# EAGLE design VA-Meter_Power_Supply (EAGLE 6.6.0)
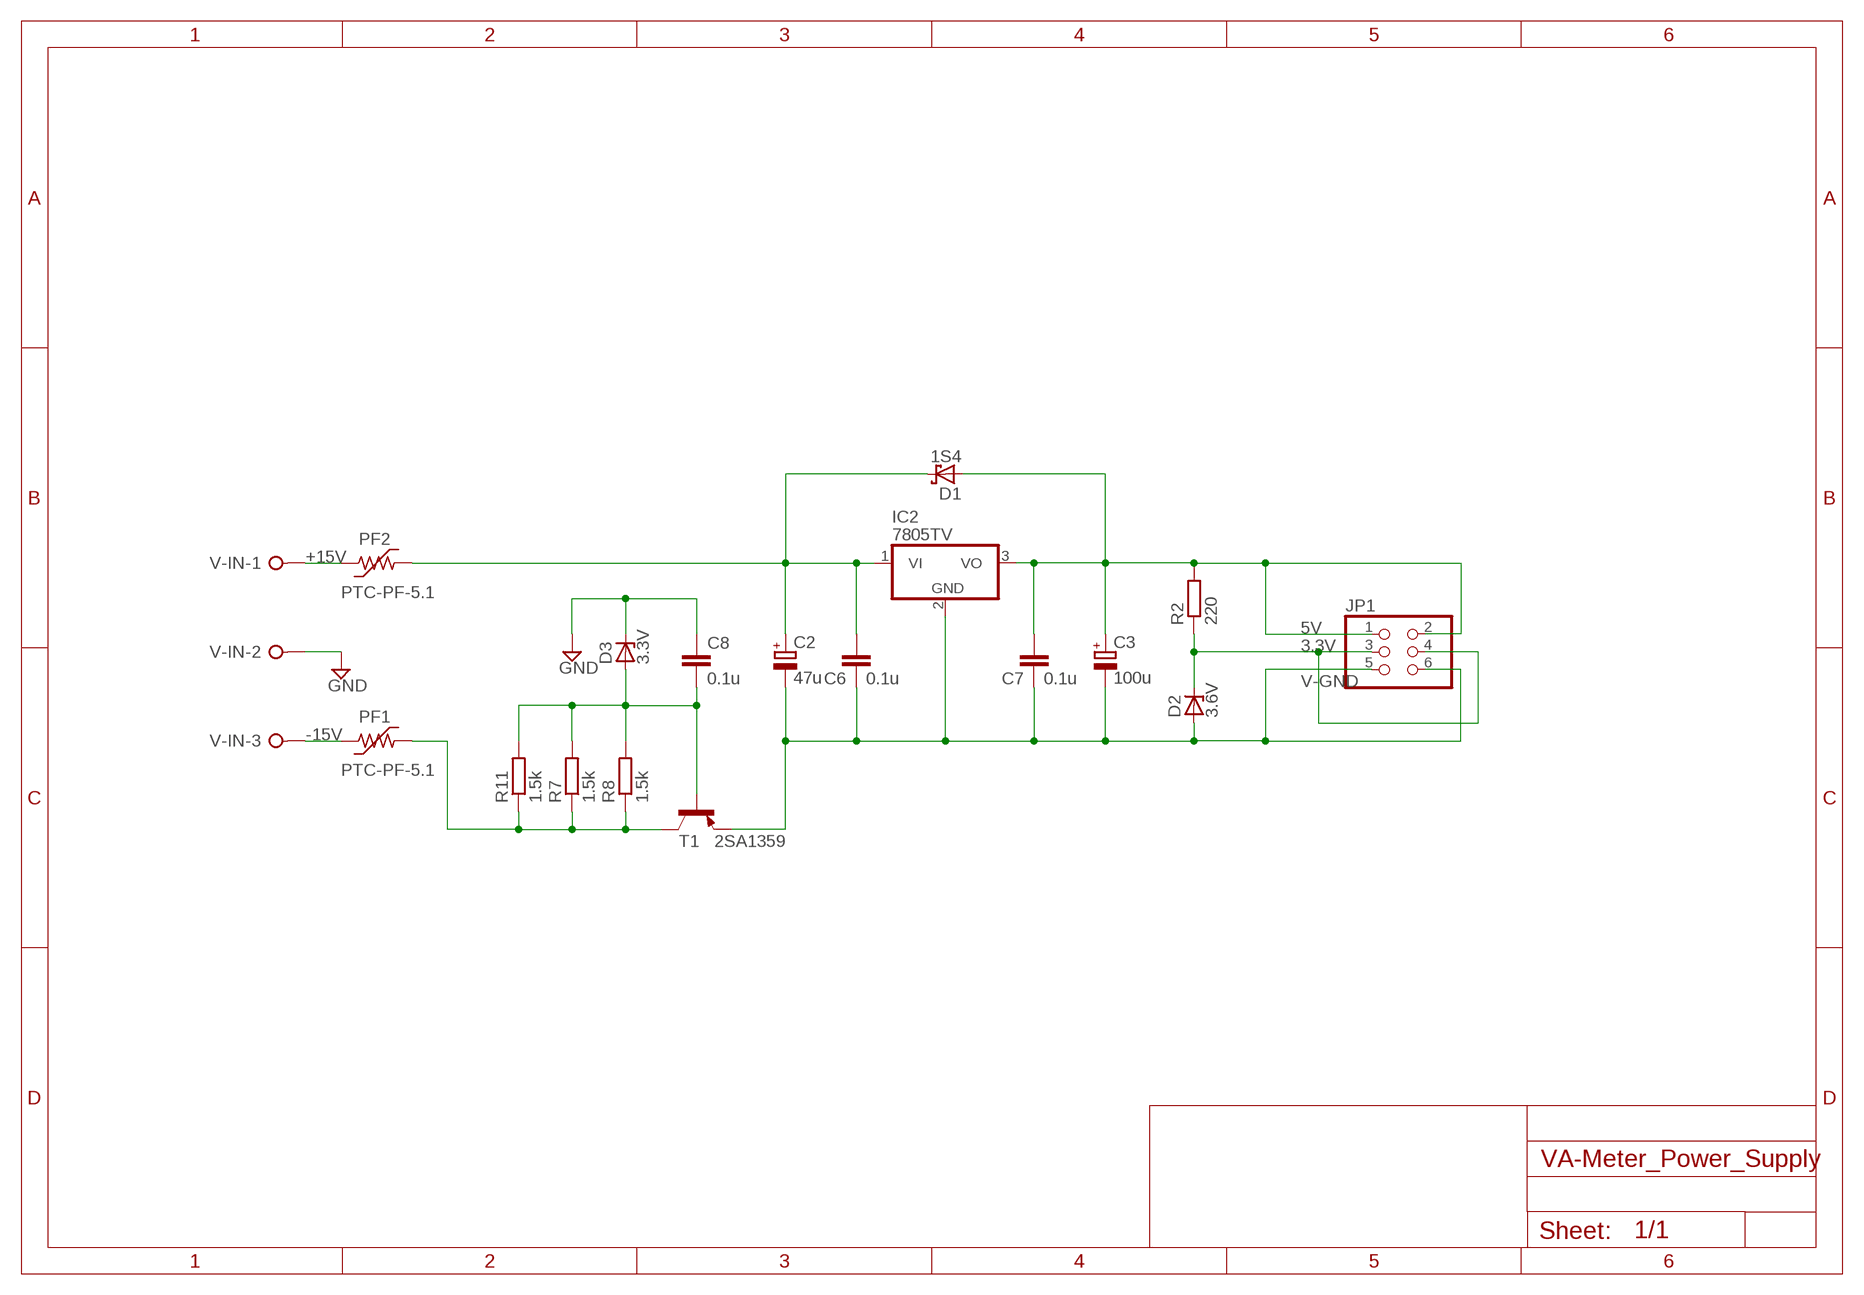
[diagram p0: schematic, sheet 1]

## Parts
C2  47u  CPOL-EUE2.5-5  [E2,5-5]
C3  100u  CPOL-EUE2.5-6  [E2,5-6]
C6  0.1u  C-EU050-024X044  [C050-024X044]
C7  0.1u  C-EU050-024X044  [C050-024X044]
C8  0.1u  C-EU050-024X044  [C050-024X044]
D1  1S4  SCHOTTKY-DIODEDO35-7  [DO35-7]
D2  3.6V  ZENER-DIODEZD-5  [ZDIO-5]
D3  3.3V  ZENER-DIODEZD-5  [ZDIO-5]
IC2  7805TV  [TO220V]
JP1  PINHD-2X3  [2X03]
PF1  PTC-PF-5.1  [PF-5.1]
PF2  PTC-PF-5.1  [PF-5.1]
R2  220  R-EU_0204/7  [0204/7]
R7  1.5k  R-EU_0207/7  [0207/7]
R8  1.5k  R-EU_0207/7  [0207/7]
R11  1.5k  R-EU_0207/7  [0207/7]
T1  2SA1359  -PNP-TO126V  [TO126V]
V-IN  W237-03P  [W237-133]

## Nets
3.3V: D2.C JP1.3 JP1.4 R2.1
5V: C3.+ C7.2 D1.A IC2.3(VO) JP1.1 JP1.2 R2.2
+15V: C2.+ C6.2 D1.C IC2.1(VI) PF2.2
-15V: PF1.2 R7.1 R8.1 R11.1 T1.2(C)
GND: C8.1 D3.C V-IN.2
N$2: C8.2 D3.A R7.2 R8.2 R11.2 T1.3(B)
N$6: PF2.1 V-IN.1
N$7: PF1.1 V-IN.3
V-GND: C2.- C3.- C6.1 C7.1 D2.A IC2.2(GND) JP1.5 JP1.6 T1.1(E)

## Library data of the parts
C2 C3 = rcl:CPOL-EU: POLARIZED CAPACITOR, European symbol
C6-C8 = rcl:C-EU: CAPACITOR, European symbol
D1 = diode:SCHOTTKY-DIODE: Schottky Diode
D2 D3 = diode:ZENER-DIODE: Z-Diode
IC2 = linear:78*: Positive VOLTAGE REGULATOR Source: http://cache.national.com/ds/LM/LM78L05.pdf http://www.fairchildsemi.com/ds/LM/LM7805.pdf
JP1 = pinhead:PINHD-2X3: PIN HEADER
PF1 PF2 = polyswitch:PTC-: POLYSWITCH Polyswitch Resetable Fuses
R2 R7 R8 R11 = rcl:R-EU_: RESISTOR, European symbol
T1 = transistor:*-PNP-: PNP Transistror
V-IN = con-wago-508:W237-03P: WAGO SREW CLAMP; OC_FARNELL: unknown; OC_NEWARK: unknown

## Board
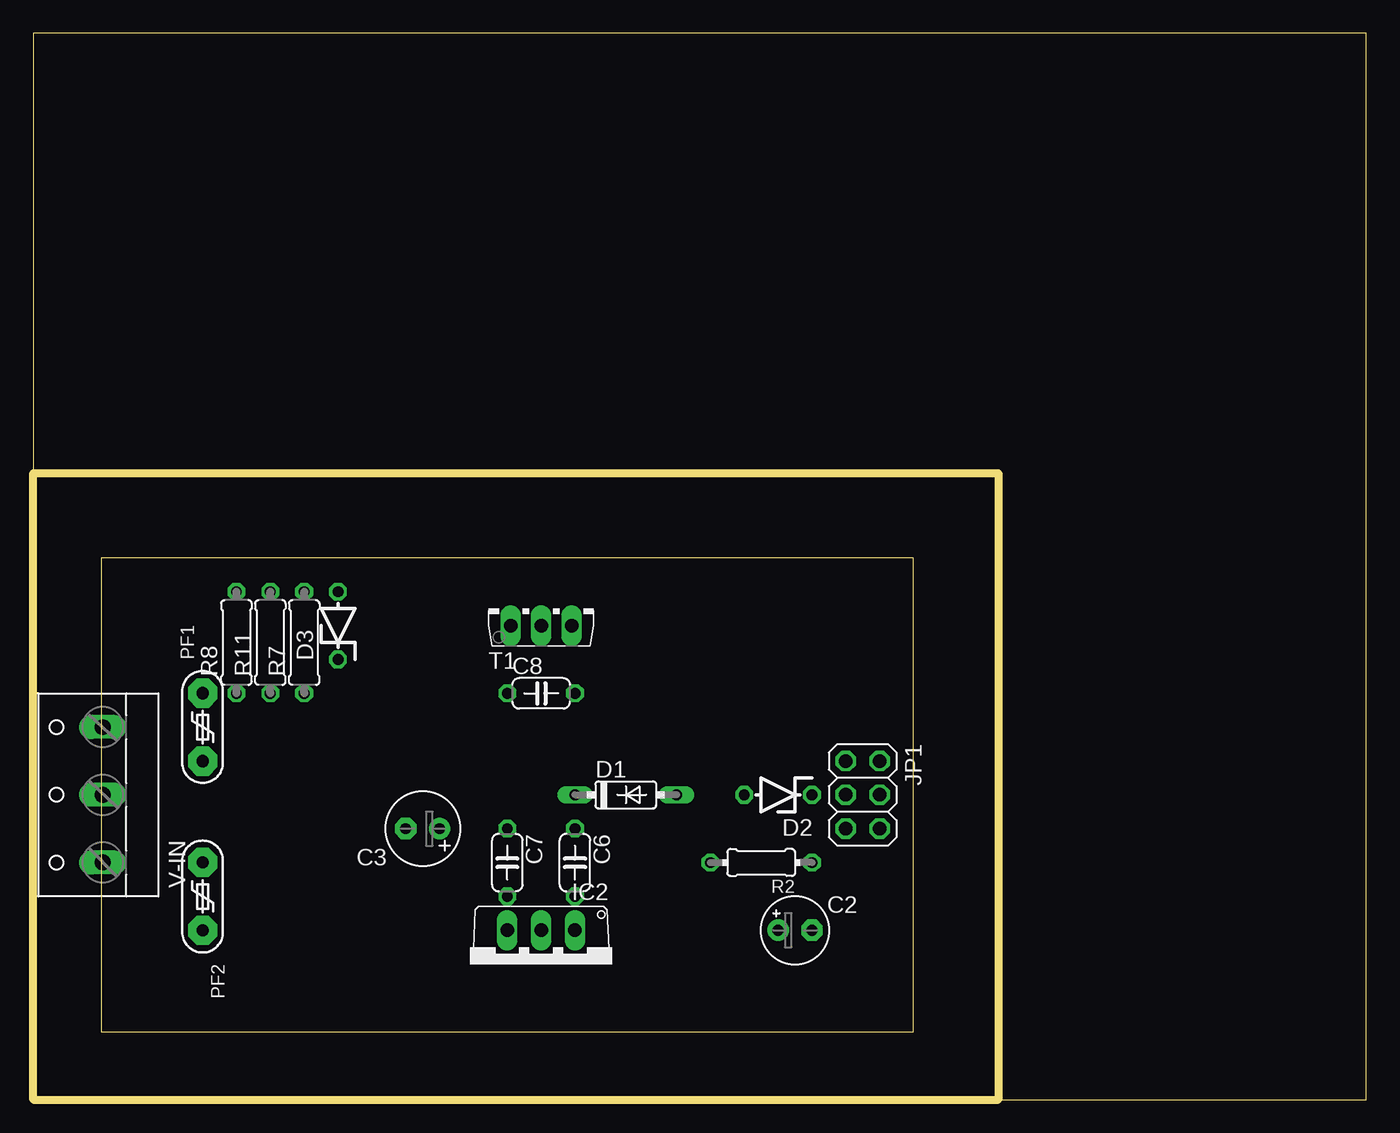
[diagram p1: board, top side]
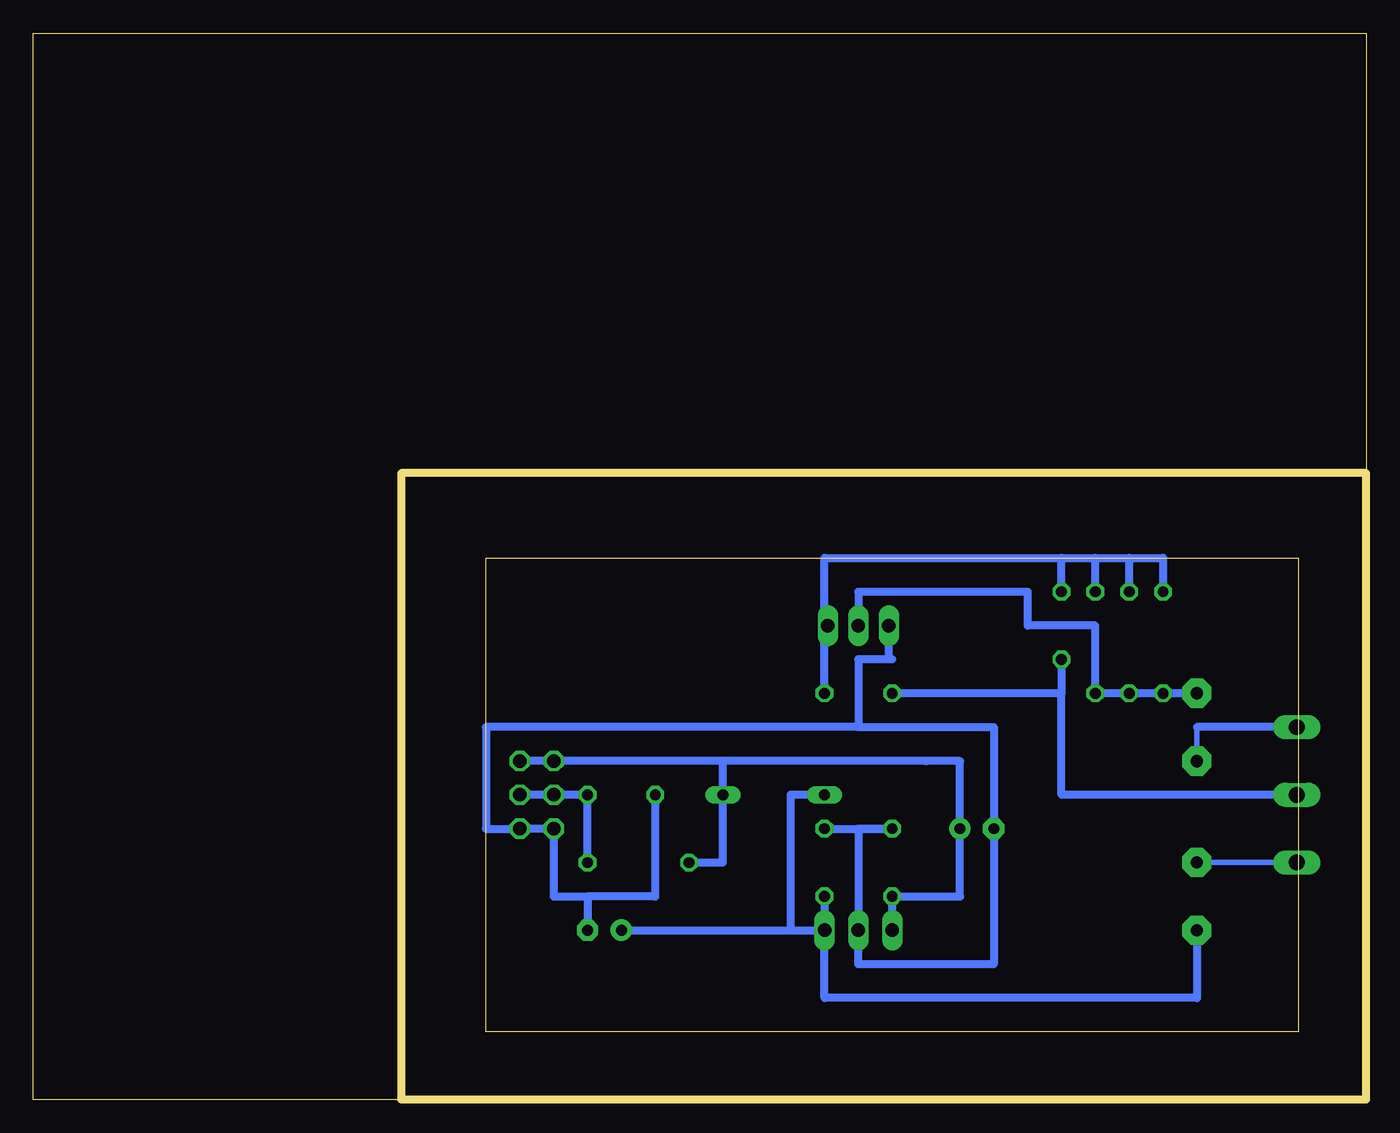
[diagram p2: board, bottom side, seen from below]

Size 100 x 80 mm. Coordinates in mm from the lower left corner, seen from the top.
Outline: 72.39,0 100,0 100,80 0,80 0,46.99
Outline: 0,46.99 0,0 72.39,0
Outline: 0,46.99 72.39,46.99 72.39,0
Outline: 5.08,5.08 66.04,5.08 66.04,40.64 5.08,40.64 5.08,5.08
Copper layers (1*16): Top 0.035mm / dielectric 1.5mm / Bottom 0.035mm
Design rules "default": minimum track width 10mil, minimum drill 24mil, track to track 8mil, track to pad 8mil, pad to pad 8mil, via to via 8mil, smd to smd 8mil, copper to edge 40mil, drill to drill 8mil, minimum pad ring 10mil, minimum via ring 8mil, stop-mask expansion 4mil, vias tented up to drill 0mil, thermal gap 10mil
tKeepout: area 25.4,0 to 50.8,15.2; area 25.4,25.4 to 50.8,45.7

### Footprints (pad centres in the part's own frame; a part is rotated, then mirrored left to right if it is on the bottom)
E2,5-5 = drill 0.813 pad 1.6: + -1.27,0 | drill 0.813 pad 1.6 octagon: - 1.27,0
E2,5-6 = drill 0.813 pad 1.6: + -1.27,0 | drill 0.813 pad 1.6 octagon: - 1.27,0
C050-024X044 = drill 0.813 octagon: 1 -2.54,0; 2 2.54,0
DO35-7 = drill 0.813 long: A 3.81,0; C -3.81,0
ZDIO-5 = drill 0.813 octagon: A 2.54,0; C -2.54,0
TO220V = drill 1.016 long: 1 -2.54,-2.54; 2 0,-2.54; 3 2.54,-2.54
2X03 = drill 1.016 octagon: 1 -2.54,-1.27; 2 -2.54,1.27; 3 0,-1.27; 4 0,1.27; 5 2.54,-1.27; 6 2.54,1.27
PF-5.1 = drill 0.914 pad 2.184 octagon: 1 -2.55,0; 2 2.55,0
0204/7 = drill 0.813 octagon: 1 -3.81,0; 2 3.81,0
0207/7 = drill 0.813 octagon: 1 -3.81,0; 2 3.81,0
TO126V = drill 1.016 long: 1 -2.286,-1.27; 2 0,-1.27; 3 2.286,-1.27
W237-133 = drill 1.194 long: 1 -5.08,-0.635; 2 0,-0.635; 3 5.08,-0.635

### Placement (x,y rotation side)
C2  57.15,12.7 0 top
C3  29.21,20.32 180 top
C6  40.64,17.78 270 top
C7  35.56,17.78 270 top
C8  38.1,30.48 0 top
D1  44.45,22.86 0 top
D2  55.88,22.86 180 top
D3  22.86,35.56 90 top
IC2  38.1,10.16 180 top
JP1  62.23,22.86 270 top
PF1  12.7,27.94 90 top
PF2  12.7,15.24 270 top
R2  54.61,17.78 180 top
R7  20.32,34.29 90 top
R8  15.24,34.29 90 top
R11  17.78,34.29 90 top
T1  38.1,36.83 0 top
V-IN  4.57,22.86 90 top

### Tracks (layer width: path | path; a pad name or v marks a point on that pad's centre or on a via)
3.3V
  Bottom 0.61: R2.1 D2.C JP1.3 JP1.4
5V
  Bottom 0.61: 48.26,25.4 33.02,25.4 30.48,25.4 C3.+ 30.48,15.24 C7.2 IC2.3 | 48.26,25.4 D1.A 48.26,17.78 R2.2 | 48.26,25.4 JP1.1 JP1.2
+15V
  Bottom 0.61: PF2.2 12.7,7.62 40.64,7.62 IC2.1 | C2.+ 43.18,12.7 | 43.18,12.7 IC2.1 | D1.C 43.18,22.86 43.18,12.7 | C6.2 IC2.1
-15V
  Bottom 0.61: PF1.2 R8.1 R11.1 R7.1 20.32,35.56 25.4,35.56 25.4,38.1 38.1,38.1 T1.2
GND
  Bottom 0.61: D3.C 22.86,30.48 | 22.86,30.48 C8.1 | V-IN.2 22.86,22.86 22.86,30.48
N$2
  Bottom 0.61: C8.2 40.64,35.31 T1.3 40.64,35.56 40.64,40.64 22.86,40.64 | 22.86,40.64 20.32,40.64 | 20.32,40.64 17.78,40.64 | 17.78,40.64 15.24,40.64 R8.2 | R11.2 17.78,40.64 | R7.2 20.32,40.64 | D3.A 22.86,40.64
N$6
  Bottom 0.406: V-IN.1 PF2.1
N$7
  Bottom 0.406: 12.7,27.94 PF1.1
  Bottom 0.61: V-IN.3 12.7,27.94
V-GND
  Bottom 0.61: 35.81,33.02 38.1,33.02 38.1,27.94 | 58.42,15.24 C2.- | 58.42,15.24 60.96,15.24 JP1.5 JP1.6 66.04,20.32 66.04,27.94 38.1,27.94 | 38.1,27.94 27.94,27.94 C3.- 27.94,10.16 38.1,10.16 IC2.2 38.1,20.32 C7.1 C6.1 | D2.A 53.34,15.24 58.42,15.24 | 35.56,33.02 35.81,33.02 | 35.81,33.02 T1.1